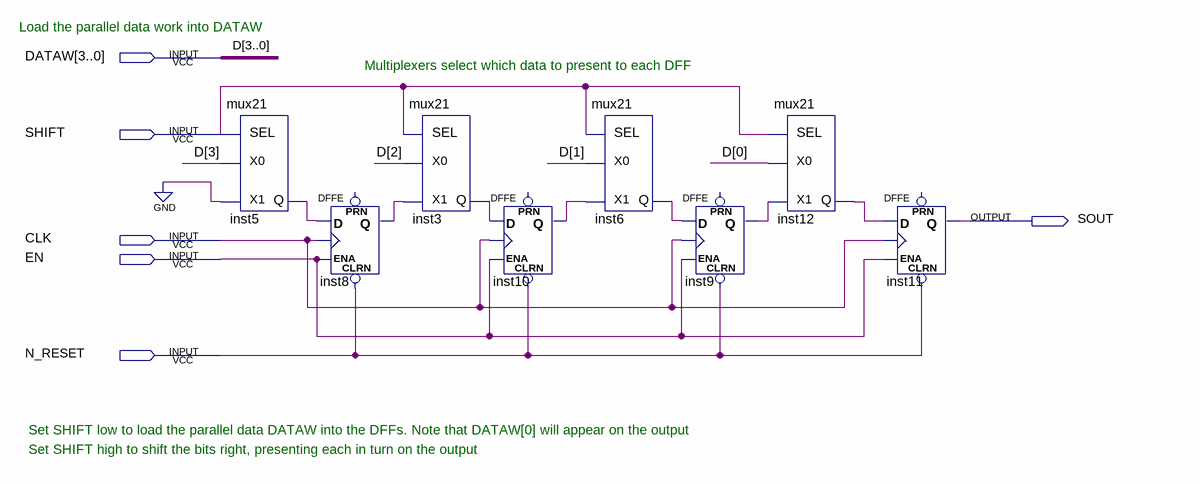
[diagram p0: schematic sheet]
// Quartus schematic p2s.bdf as structural Verilog: 8 symbols, 6 pins
module p2s (
  input  [3:0] DATAW,
  input  SHIFT,
  input  CLK,
  input  EN,
  input  N_RESET,
  output SOUT
);

  wire inst3_q, inst5_q, inst6_q, inst8_q, inst9_q, inst10_q, inst12_q;

  mux21 inst5 (.X0(DATAW[3]), .X1(1'b0), .SEL(SHIFT), .Q(inst5_q));
  DFFE inst8 (.CLRN(N_RESET), .D(inst5_q), .CLK(CLK), .ENA(EN), .Q(inst8_q));  // open: PRN
  mux21 inst3 (.X0(DATAW[2]), .X1(inst8_q), .SEL(SHIFT), .Q(inst3_q));
  DFFE inst10 (.CLRN(N_RESET), .D(inst3_q), .CLK(CLK), .ENA(EN), .Q(inst10_q));  // open: PRN
  mux21 inst6 (.X0(DATAW[1]), .X1(inst10_q), .SEL(SHIFT), .Q(inst6_q));
  DFFE inst9 (.CLRN(N_RESET), .D(inst6_q), .CLK(CLK), .ENA(EN), .Q(inst9_q));  // open: PRN
  mux21 inst12 (.X0(DATAW[0]), .X1(inst9_q), .SEL(SHIFT), .Q(inst12_q));
  DFFE inst11 (.CLRN(N_RESET), .D(inst12_q), .CLK(CLK), .ENA(EN), .Q(SOUT));  // open: PRN

  // Other names for the same wires on the sheet: D[3:0] = DATAW

  // Notes on the sheet:
  //   Load the parallel data work into DATAW
  //   Multiplexers select which data to present to each DFF
  //   Set SHIFT low to load the parallel data DATAW into the DFFs. Note that DATAW[0] will appear on the output
  //   Set SHIFT high to shift the bits right, presenting each in turn on the output
endmodule
